# EasyEDA schematic MBedRoom_BaseBoard.json
TITLE: Sheet_1; REV: 1.0; Date: 2026-09-06; Sheet: 1/1; Company: Your Company
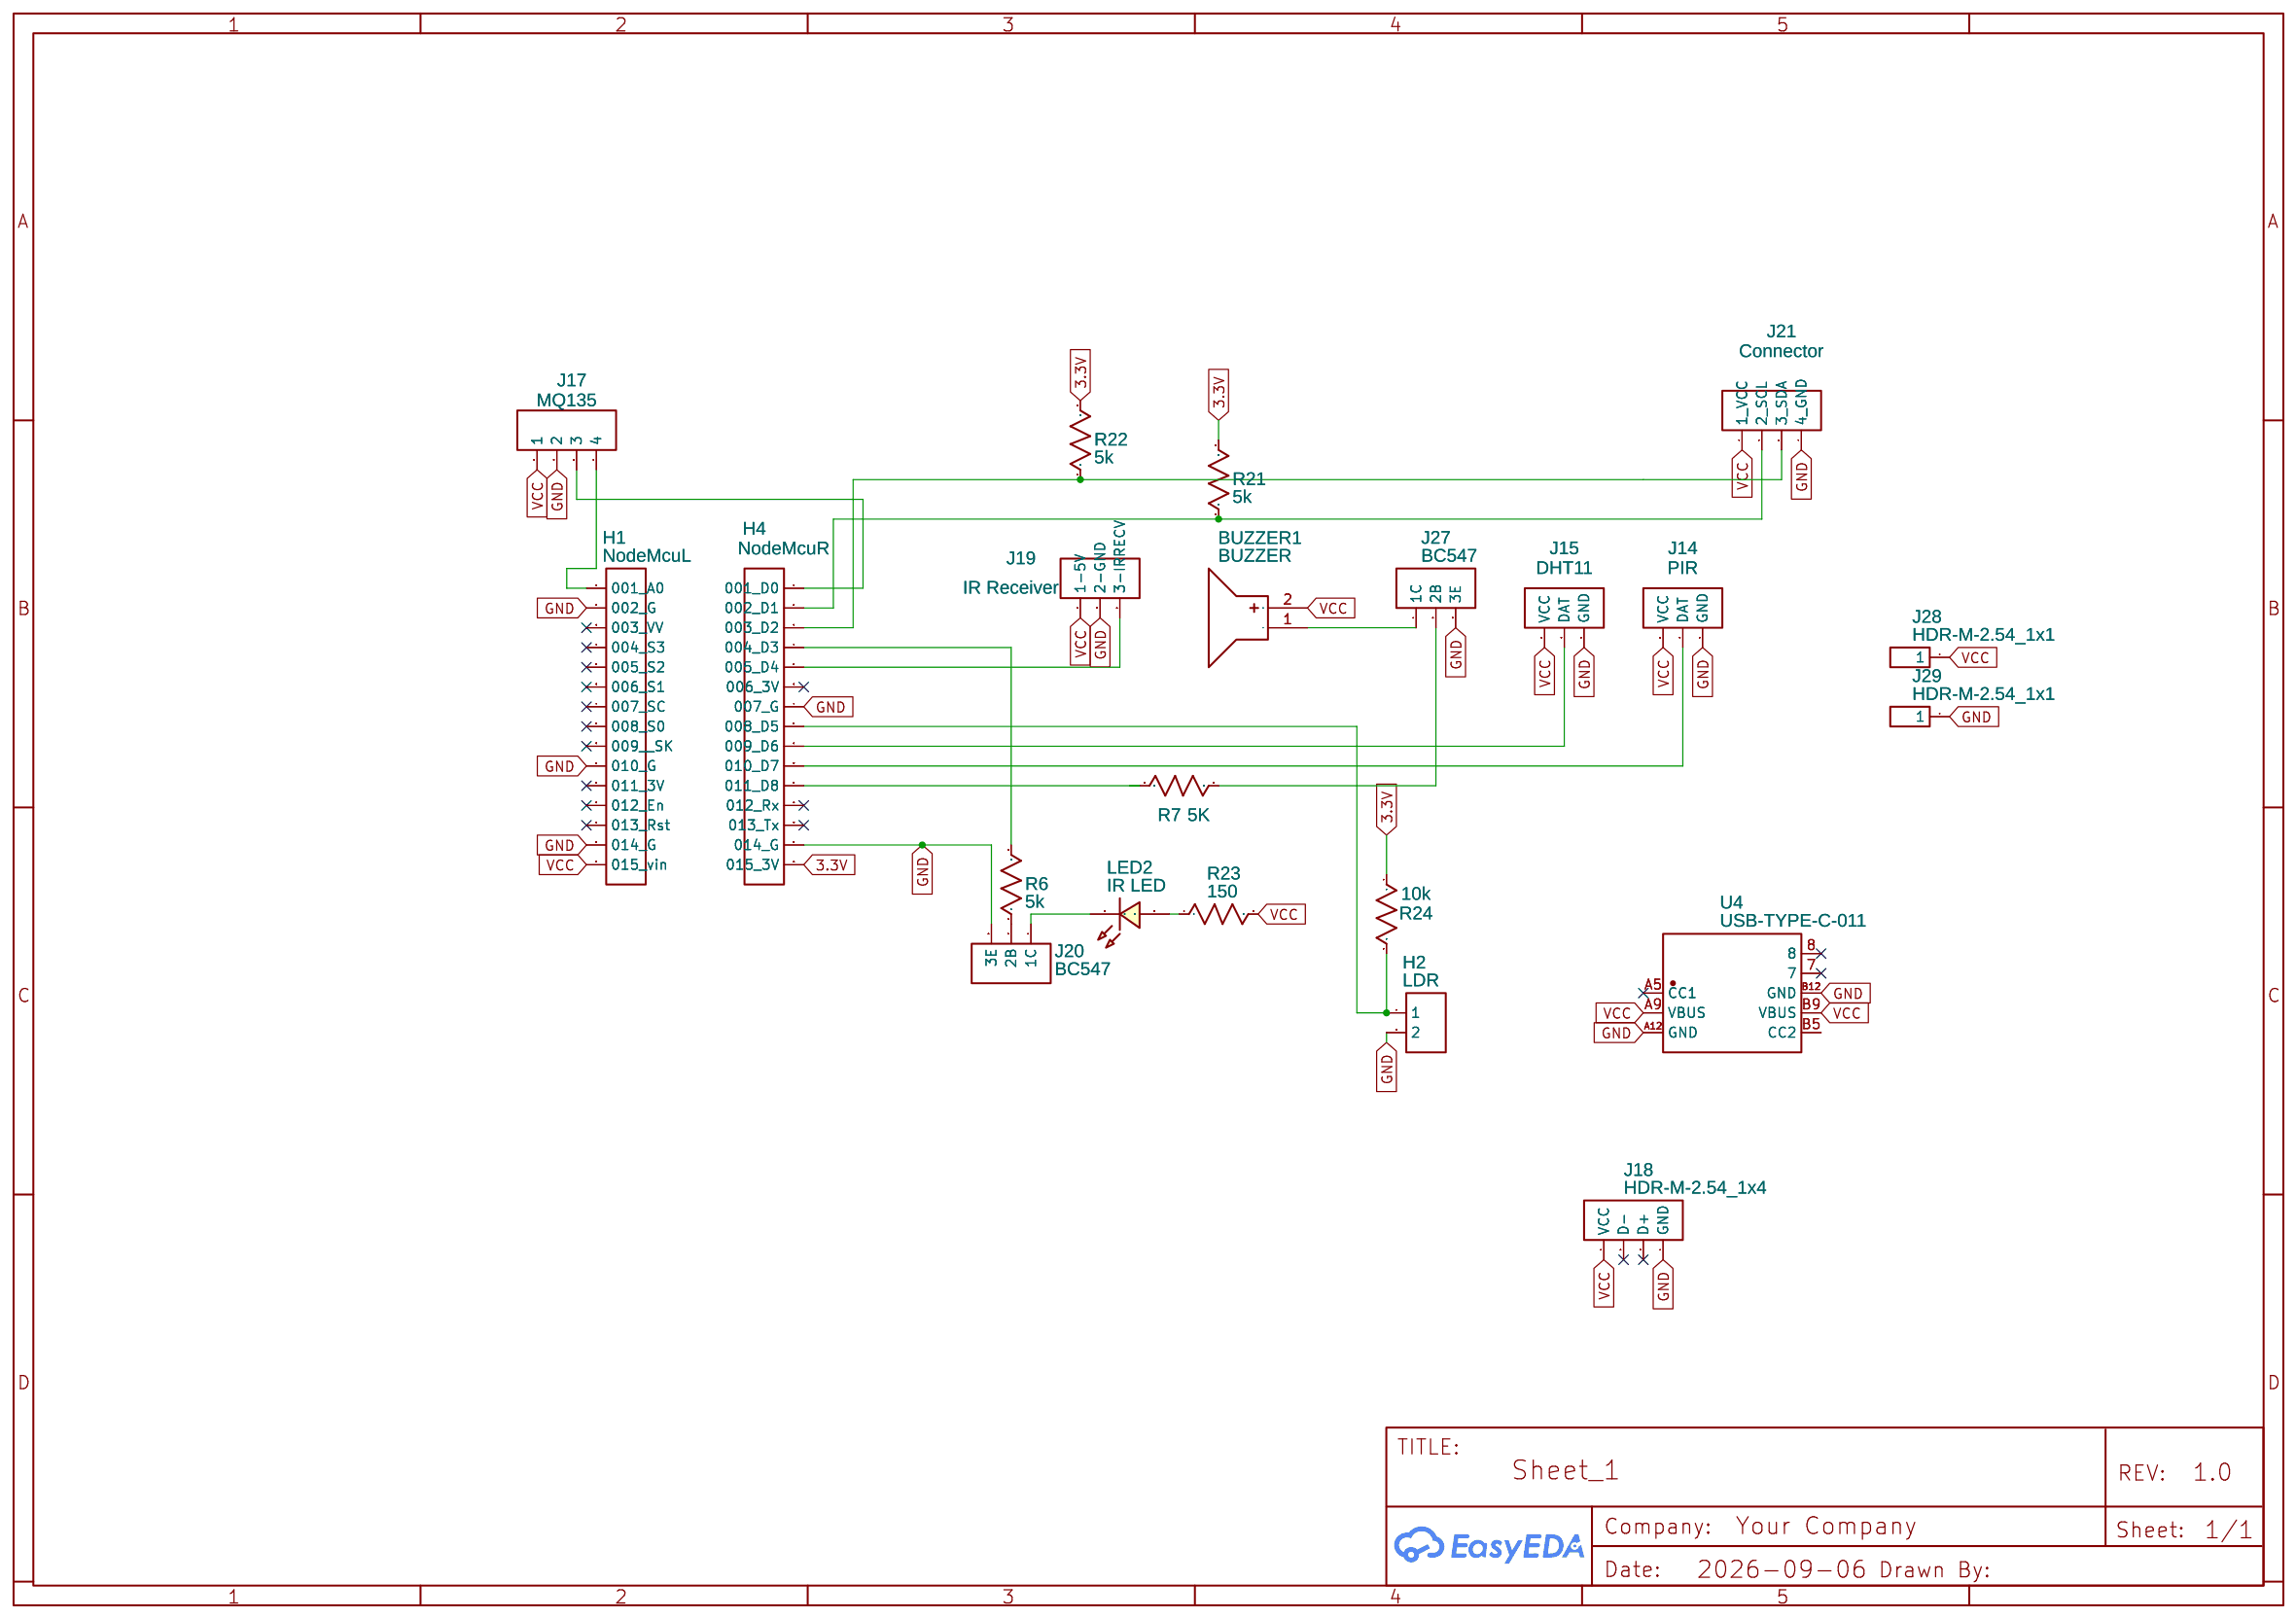
[diagram p0: schematic sheet]

## Parts
BUZZER1  BUZZER  [BUZ-TH_BD12.0-P6.00-D0.9-RD]
H1  NodeMcuL  [HDR-F-2.54_1X15]
H2  LDR  [HDR-F-2.54_1X2]
H4  NodeMcuR  [HDR-F-2.54_1X15]
J14  PIR  [HDR-M-2.54_1X3]
J15  DHT11  [HDR-M-2.54_1X3]
J17  MQ135  [HDR-M-2.54_1X4]
J18  HDR-M-2.54_1x4  [HDR-M-2.54_1X4]
J19  IR Receiver  [HDR-M-2.54_1X3]
J20  BC547  [HDR-M-2.54_1X3]
J21  Connector  [HDR-M-2.54_1X4]
J27  BC547  [HDR-M-2.54_1X3]
J28  HDR-M-2.54_1x1  [HDR-M-2.54_1X1]
J29  HDR-M-2.54_1x1  [HDR-M-2.54_1X1]
LED2  IR LED  [LED-TH_BD5.0_RED]
R6  5k  [R_AXIAL-0.4]
R7  5K  [R_AXIAL-0.4]
R21  5k  [R_AXIAL-0.4]
R22  5k  [R_AXIAL-0.4]
R23  150  [R_AXIAL-0.4]
R24  10k  [R_AXIAL-0.3]
U4  USB-TYPE-C-011  [USB-C-SMD_TYC-252D-CB160]

## Library data of the parts
BUZZER1 = BUZZER: Contributor: lcsc; Supplier: LCSC; Supplier Part: C9900014030; Manufacturer: null; Manufacturer Part: buzzer; JLCPCB Part Class: Extended Part
H1 H4 = HDR-F-2.54_1x15: Supplier Part: C124408; Supplier: LCSC; Contributor: LCEDA_Lib
H2 = HDR-F-2.54_1x2: Supplier Part: C49661; Supplier: LCSC; Contributor: LCEDA_Lib
J14 J15 J19 J20 J27 = HDR-M-2.54_1x3: Supplier Part: C180248; Supplier: LCSC; Contributor: LCEDA_Lib
J17 J18 J21 = HDR-M-2.54_1x4: Supplier Part: C124378; Supplier: LCSC; Contributor: LCEDA_Lib
J28 J29 = HDR-M-2.54_1x1: Supplier Part: C81276; Supplier: LCSC; Contributor: LCEDA_Lib
LED2 = LED-TH-5mm_R: Manufacturer: EVERLIGHT(台湾亿光); Manufacturer Part: 333-2SURD/S530-A3; Supplier Part: C87271; Supplier: LCSC; Contributor: LCEDA_Lib
R6 R7 R21-R23 = R_AXIAL-0.4_US: Contributor: LCEDA_Lib
R24 = R_AXIAL-0.3_US: Contributor: LCEDA_Lib
U4 = USB-TYPE-C-011: Contributor: lcsc; Supplier: LCSC; Supplier Part: C2927031; Manufacturer: DEALON(德艺隆); JLCPCB Part Class: Extended Part

## Nets
3.3V: H4.15(015 3V) R21.2 R22.2 R24.1
GND: H1.2(002 G) H1.10(010 G) H1.14(014 G) H2.2 H4.7(007 G) H4.14(014 G) J14.1(GND) J15.1(GND) J17.2 J18.4(GND) J19.2(2-GND) J20.3(3E) J21.4(4 GND) J27.3(3E) J29.1 U4.A12(GND) U4.B12(GND)
VCC: BUZZER1.2(+) H1.15(015 vin) J14.3(VCC) J15.3(VCC) J17.1 J18.1(VCC) J19.1(1-5V) J21.1(1 VCC) J28.1 R23.2 U4.A9(VBUS) U4.B9(VBUS)
Net-(BUZZER1-1): BUZZER1.1(-) J27.1(1C)
Net-(H1-1): H1.1(001 A0) J17.4
Net-(H2-1): H2.1 H4.8(008 D5) R24.2
Net-(H4-1): H4.1(001 D0) J17.3
Net-(H4-2): H4.2(002 D1) J21.2(2 SCL) R21.1
Net-(H4-3): H4.3(003 D2) J21.3(3 SDA) R22.1
Net-(H4-4): H4.4(004 D3) R6.2
Net-(H4-5): H4.5(005 D4) J19.3(3-IRRECV)
Net-(H4-9): H4.9(009 D6) J15.2(DAT)
Net-(H4-10): H4.10(010 D7) J14.2(DAT)
Net-(H4-11): H4.11(011 D8) R7.1
Net-(J20-1): J20.1(1C) LED2.2
Net-(J20-2): J20.2(2B) R6.1
Net-(J27-2): J27.2(2B) R7.2
Net-(LED2-1): LED2.1 R23.1

Not connected (* = marked no-connect by the designer): H1 3(003 VV)* 4(004 S3)* 5(005 S2)* 6(006 S1)* 7(007 SC)* 8(008 S0)* 9(009  SK)* 11(011 3V)* 12(012 En)* 13(013 Rst)*; H4 6(006 3V)* 12(012 Rx)* 13(013 Tx)*; J18 2(D-)* 3(D+)*; U4 7* 8* A5(CC1)* B5(CC2)
